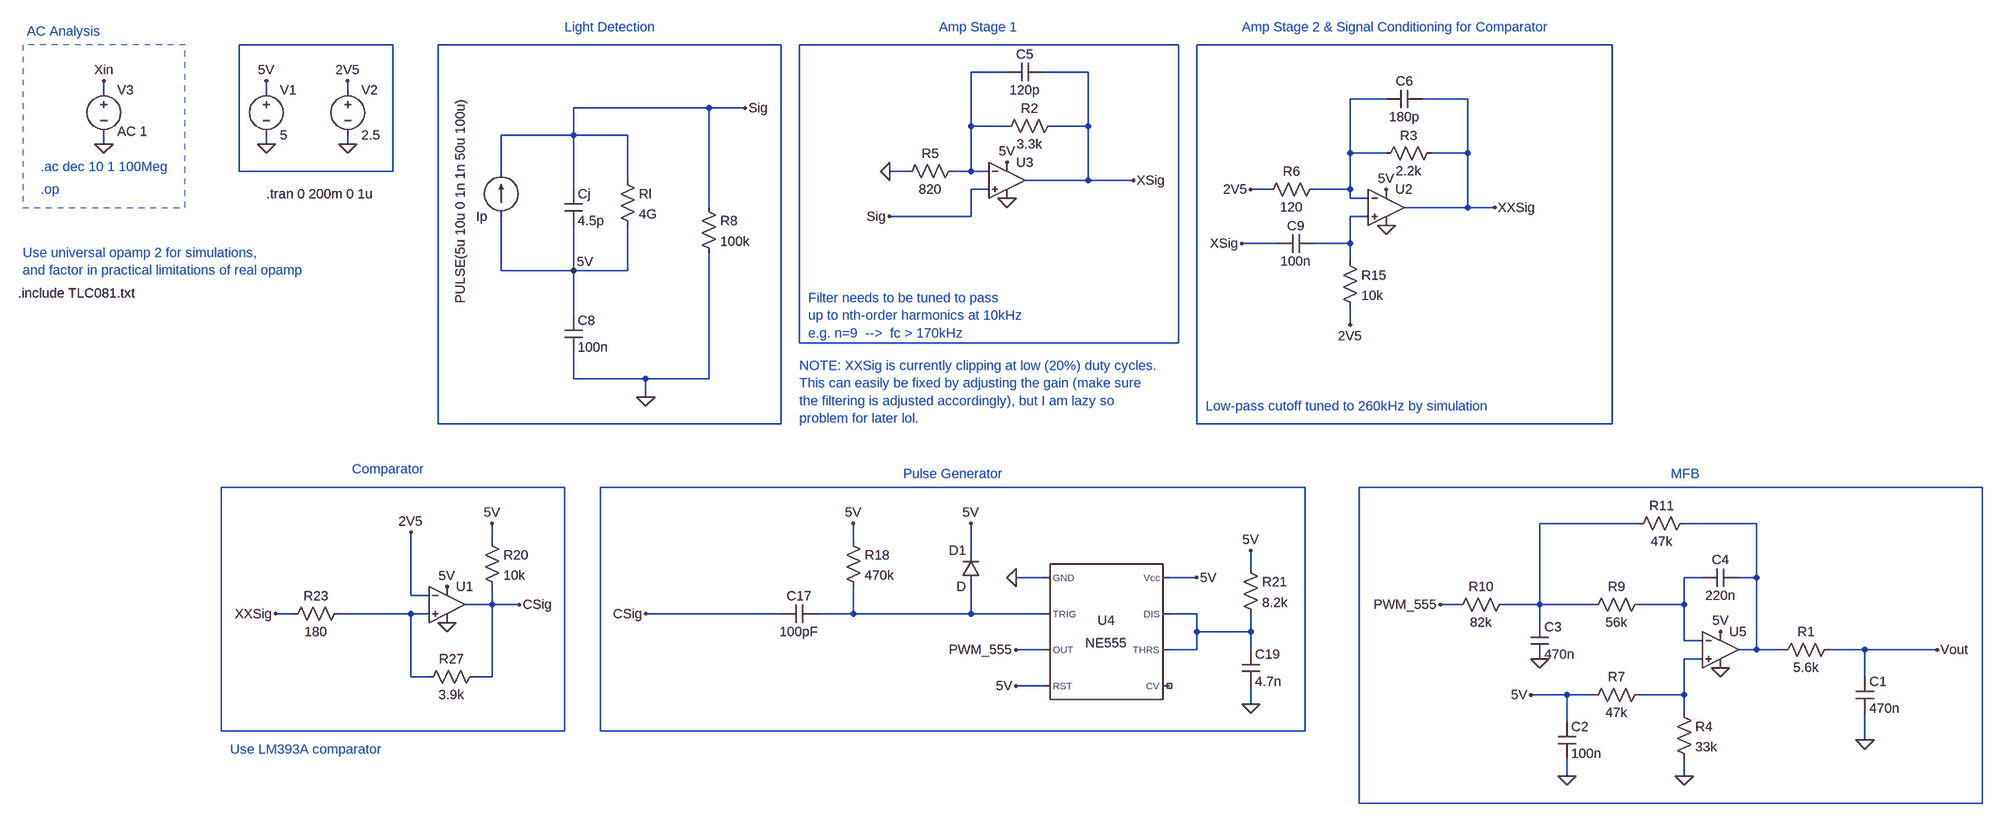
[diagram p0: schematic 310_Rx_Circuit.asc]
310_Rx_Circuit.asc, the LTspice schematic file:
Version 4.1
SHEET 1 2940 1236
WIRE -352 -112 -624 -112
WIRE 336 -112 -272 -112
WIRE 1040 -112 368 -112
WIRE 1808 -112 1072 -112
WIRE 736 -64 672 -64
WIRE 880 -64 800 -64
WIRE -864 -32 -864 -48
WIRE -576 -32 -576 -48
WIRE -432 -32 -432 -48
WIRE 1408 -16 1344 -16
WIRE 1552 -16 1472 -16
WIRE 208 0 -32 0
WIRE 272 0 208 0
WIRE 672 32 672 -64
WIRE 736 32 672 32
WIRE 880 32 880 -64
WIRE 880 32 816 32
WIRE -32 48 -32 0
WIRE -32 48 -160 48
WIRE 64 48 -32 48
WIRE -864 64 -864 48
WIRE -576 64 -576 48
WIRE -432 64 -432 48
WIRE 1344 80 1344 -16
WIRE 1408 80 1344 80
WIRE 1552 80 1552 -16
WIRE 1552 80 1488 80
WIRE -624 112 -624 -112
WIRE -352 112 -352 -112
WIRE -352 112 -624 112
WIRE -160 112 -160 48
WIRE 560 112 528 112
WIRE 672 112 672 32
WIRE 672 112 640 112
WIRE 704 112 672 112
WIRE 64 128 64 48
WIRE 880 128 880 32
WIRE 880 128 768 128
WIRE 960 128 880 128
WIRE -32 144 -32 48
WIRE 704 144 672 144
WIRE 1200 144 1168 144
WIRE 1344 144 1344 80
WIRE 1344 144 1280 144
WIRE 1344 160 1344 144
WIRE 1376 160 1344 160
WIRE 208 176 208 0
WIRE 1552 176 1552 80
WIRE 1552 176 1440 176
WIRE 1600 176 1552 176
WIRE 672 192 672 144
WIRE 672 192 528 192
WIRE 1376 192 1344 192
WIRE 1216 240 1152 240
WIRE 1344 240 1344 192
WIRE 1344 240 1280 240
WIRE 1344 272 1344 240
WIRE -160 288 -160 192
WIRE -32 288 -32 208
WIRE -32 288 -160 288
WIRE 64 288 64 208
WIRE 64 288 -32 288
WIRE -32 368 -32 288
WIRE 1344 384 1344 352
WIRE 368 416 368 -112
WIRE 1040 416 1040 -112
WIRE 1040 416 368 416
WIRE -32 480 -32 432
WIRE 96 480 -32 480
WIRE 208 480 208 256
WIRE 208 480 96 480
WIRE 96 512 96 480
WIRE -272 560 -272 -112
WIRE 336 560 336 -112
WIRE 336 560 -272 560
WIRE 1072 560 1072 -112
WIRE 1808 560 1808 -112
WIRE 1808 560 1072 560
WIRE -48 672 -656 672
WIRE 1264 672 16 672
WIRE 2464 672 1360 672
WIRE 1856 736 1680 736
WIRE 2064 736 1936 736
WIRE -176 768 -176 736
WIRE 464 768 464 736
WIRE 672 784 672 736
WIRE 1168 816 1168 784
WIRE 800 832 752 832
WIRE 1072 832 1024 832
WIRE 1968 832 1936 832
WIRE 2064 832 2064 736
WIRE 2064 832 2032 832
WIRE -320 864 -320 752
WIRE -288 864 -320 864
WIRE -176 880 -176 848
WIRE -176 880 -224 880
WIRE -128 880 -176 880
WIRE 1536 880 1504 880
WIRE 1680 880 1680 736
WIRE 1680 880 1616 880
WIRE 1776 880 1680 880
WIRE 1936 880 1936 832
WIRE 1936 880 1856 880
WIRE -528 896 -560 896
WIRE -320 896 -448 896
WIRE -288 896 -320 896
WIRE 336 896 96 896
WIRE 464 896 464 848
WIRE 464 896 400 896
WIRE 672 896 672 848
WIRE 672 896 464 896
WIRE 800 896 672 896
WIRE 1072 896 1024 896
WIRE 1680 912 1680 880
WIRE 1072 928 1072 896
WIRE 1168 928 1168 896
WIRE 1168 928 1072 928
WIRE 1936 944 1936 880
WIRE 1968 944 1936 944
WIRE 800 960 752 960
WIRE 1072 960 1072 928
WIRE 1072 960 1024 960
WIRE 1168 960 1168 928
WIRE 2064 960 2064 832
WIRE 2064 960 2032 960
WIRE 2112 960 2064 960
WIRE 2256 960 2192 960
WIRE 2384 960 2256 960
WIRE 1968 976 1936 976
WIRE -320 1008 -320 896
WIRE -288 1008 -320 1008
WIRE -176 1008 -176 880
WIRE -176 1008 -208 1008
WIRE 2256 1008 2256 960
WIRE 800 1024 752 1024
WIRE 1728 1040 1664 1040
WIRE 1776 1040 1728 1040
WIRE 1936 1040 1936 976
WIRE 1936 1040 1856 1040
WIRE 1168 1056 1168 1024
WIRE 1936 1072 1936 1040
WIRE 1728 1088 1728 1040
WIRE -656 1104 -656 672
WIRE -48 1104 -48 672
WIRE -48 1104 -656 1104
WIRE 16 1104 16 672
WIRE 1264 1104 1264 672
WIRE 1264 1104 16 1104
WIRE 2256 1120 2256 1072
WIRE 1728 1184 1728 1152
WIRE 1936 1184 1936 1152
WIRE 1360 1232 1360 672
WIRE 2464 1232 2464 672
WIRE 2464 1232 1360 1232
FLAG -576 -48 5V
FLAG -576 64 0
FLAG -432 -48 2V5
FLAG -432 64 0
FLAG -256 848 5V
FLAG -256 912 0
FLAG -320 752 2V5
FLAG -560 896 XXSig
FLAG -128 880 CSig
FLAG 1072 832 5V
FLAG 752 832 0
FLAG 752 960 PWM_555
FLAG 752 1024 5V
FLAG 464 736 5V
FLAG 672 736 5V
FLAG 96 896 CSig
FLAG 1168 784 5V
FLAG 1168 1056 0
FLAG -32 288 5V
FLAG 96 512 0
FLAG 272 0 Sig
FLAG 960 128 XSig
FLAG 528 112 0
FLAG 528 192 Sig
FLAG 736 160 0
FLAG 736 96 5V
FLAG 1344 384 2V5
FLAG 1600 176 XXSig
FLAG 1408 144 5V
FLAG 1408 208 0
FLAG 1168 144 2V5
FLAG -176 736 5V
FLAG -864 64 0
FLAG -864 -48 Xin
FLAG 1152 240 XSig
FLAG 2256 1120 0
FLAG 1936 1184 0
FLAG 1664 1040 5V
FLAG 1728 1184 0
FLAG 1680 976 0
FLAG 2000 928 5V
FLAG 2000 992 0
FLAG 1504 880 PWM_555
FLAG 2384 960 Vout
SYMBOL voltage -576 -48 R0
WINDOW 123 0 0 Left 0
WINDOW 39 0 0 Left 0
SYMATTR InstName V1
SYMATTR Value 5
SYMBOL voltage -432 -48 R0
WINDOW 123 0 0 Left 0
WINDOW 39 0 0 Left 0
SYMATTR InstName V2
SYMATTR Value 2.5
SYMBOL res -432 880 R90
WINDOW 0 0 56 VBottom 2
WINDOW 3 32 56 VTop 2
SYMATTR InstName R23
SYMATTR Value 180
SYMBOL res -304 1024 R270
WINDOW 0 32 56 VTop 2
WINDOW 3 0 56 VBottom 2
SYMATTR InstName R27
SYMATTR Value 3.9k
SYMBOL Misc\\NE555 912 928 R0
SYMATTR InstName U4
SYMBOL res 448 752 R0
SYMATTR InstName R18
SYMATTR Value 470k
SYMBOL cap 400 880 R90
WINDOW 0 0 32 VBottom 2
WINDOW 3 32 32 VTop 2
SYMATTR InstName C17
SYMATTR Value 100pF
SYMBOL res 1152 800 R0
SYMATTR InstName R21
SYMATTR Value 8.2k
SYMBOL cap 1152 960 R0
SYMATTR InstName C19
SYMATTR Value 4.7n
SYMBOL current -160 192 R180
WINDOW 3 72 -155 VRight 2
WINDOW 123 0 0 Left 0
WINDOW 39 0 0 Left 0
SYMATTR Value PULSE(5u 10u 0 1n 1n 50u 100u)
SYMATTR InstName Ip
SYMBOL cap -48 144 R0
SYMATTR InstName Cj
SYMATTR Value 4.5p
SYMBOL res 48 112 R0
SYMATTR InstName Rl
SYMATTR Value 4G
SYMBOL cap -48 368 R0
SYMATTR InstName C8
SYMATTR Value 100n
SYMBOL res 192 160 R0
SYMATTR InstName R8
SYMATTR Value 100k
SYMBOL res 832 16 R90
WINDOW 0 0 56 VBottom 2
WINDOW 3 32 56 VTop 2
SYMATTR InstName R2
SYMATTR Value 3.3k
SYMBOL res 656 96 R90
WINDOW 0 0 56 VBottom 2
WINDOW 3 32 56 VTop 2
SYMATTR InstName R5
SYMATTR Value 820
SYMBOL res 1328 256 R0
SYMATTR InstName R15
SYMATTR Value 10k
SYMBOL cap 1280 224 R90
WINDOW 0 0 32 VBottom 2
WINDOW 3 32 32 VTop 2
SYMATTR InstName C9
SYMATTR Value 100n
SYMBOL res 1504 64 R90
WINDOW 0 0 56 VBottom 2
WINDOW 3 32 56 VTop 2
SYMATTR InstName R3
SYMATTR Value 2.2k
SYMBOL res 1296 128 R90
WINDOW 0 0 56 VBottom 2
WINDOW 3 32 56 VTop 2
SYMATTR InstName R6
SYMATTR Value 120
SYMBOL res -192 752 R0
SYMATTR InstName R20
SYMATTR Value 10k
SYMBOL OpAmps\\UniversalOpAmp2 -256 880 R0
SYMATTR InstName U1
SYMBOL OpAmps\\UniversalOpAmp2 1408 176 R0
SYMATTR InstName U2
SYMBOL OpAmps\\UniversalOpAmp2 736 128 R0
SYMATTR InstName U3
SYMBOL voltage -864 -48 R0
WINDOW 3 24 89 Left 2
WINDOW 123 24 72 Left 2
WINDOW 39 0 0 Left 0
SYMATTR Value AC 1
SYMATTR InstName V3
SYMBOL diode 688 848 R180
WINDOW 0 24 64 Left 2
WINDOW 3 24 0 Left 2
SYMATTR InstName D1
SYMBOL OpAmps\\UniversalOpAmp2 2000 960 R0
SYMATTR InstName U5
SYMBOL res 2208 944 R90
WINDOW 0 0 56 VBottom 2
WINDOW 3 32 56 VTop 2
SYMATTR InstName R1
SYMATTR Value 5.6k
SYMBOL cap 2240 1008 R0
SYMATTR InstName C1
SYMATTR Value 470n
SYMBOL res 1920 1056 R0
SYMATTR InstName R4
SYMATTR Value 33k
SYMBOL res 1872 1024 R90
WINDOW 0 0 56 VBottom 2
WINDOW 3 32 56 VTop 2
SYMATTR InstName R7
SYMATTR Value 47k
SYMBOL cap 1712 1088 R0
SYMATTR InstName C2
SYMATTR Value 100n
SYMBOL res 1872 864 R90
WINDOW 0 0 56 VBottom 2
WINDOW 3 32 56 VTop 2
SYMATTR InstName R9
SYMATTR Value 56k
SYMBOL res 1632 864 R90
WINDOW 0 0 56 VBottom 2
WINDOW 3 32 56 VTop 2
SYMATTR InstName R10
SYMATTR Value 82k
SYMBOL cap 1664 912 R0
SYMATTR InstName C3
SYMATTR Value 470n
SYMBOL cap 2032 816 R90
WINDOW 0 0 32 VBottom 2
WINDOW 3 32 32 VTop 2
SYMATTR InstName C4
SYMATTR Value 220n
SYMBOL res 1952 720 R90
WINDOW 0 0 56 VBottom 2
WINDOW 3 32 56 VTop 2
SYMATTR InstName R11
SYMATTR Value 47k
SYMBOL cap 800 -80 R90
WINDOW 0 0 32 VBottom 2
WINDOW 3 32 32 VTop 2
SYMATTR InstName C5
SYMATTR Value 120p
SYMBOL cap 1472 -32 R90
WINDOW 0 0 32 VBottom 2
WINDOW 3 32 32 VTop 2
SYMATTR InstName C6
SYMATTR Value 180p
TEXT -48 -144 Left 2 ;Light Detection
TEXT 616 -144 Left 2 ;Amp Stage 1
TEXT -576 152 Left 2 !.tran 0 200m 0 1u
TEXT 1152 -144 Left 2 ;Amp Stage 2 & Signal Conditioning for Comparator
TEXT -424 640 Left 2 ;Comparator
TEXT -1016 328 Left 2 !.include TLC081.txt
TEXT -976 104 Left 2 ;.ac dec 10 1 100Meg
TEXT -976 144 Left 2 ;.op
TEXT -1008 256 Left 2 ;Use universal opamp 2 for simulations, \nand factor in practical limitations of real opamp
TEXT -640 1136 Left 2 ;Use LM393A comparator
TEXT 384 336 Left 2 ;Filter needs to be tuned to pass \nup to nth-order harmonics at 10kHz\ne.g. n=9  -->  fc > 170kHz
TEXT 1088 528 Left 2 ;Low-pass cutoff tuned to 260kHz by simulation
TEXT -1000 -136 Left 2 ;AC Analysis
TEXT 368 456 Left 2 ;NOTE: XXSig is currently clipping at low (20%) duty cycles.\nThis can easily be fixed by adjusting the gain (make sure \nthe filtering is adjusted accordingly), but I am lazy so\nproblem for later lol.
TEXT 552 648 Left 2 ;Pulse Generator
TEXT 1912 648 Left 2 ;MFB
LINE Normal -720 176 -720 -112 2
LINE Normal -1008 176 -720 176 2
LINE Normal -1008 -112 -1008 176 2
LINE Normal -720 -112 -1008 -112 2

The netlist it stands for:
* 310_Rx_Circuit.asc
V1 5V 0 5
V2 2V5 0 2.5
R23 N014 XXSig 180
R27 N014 CSig 3.9k
X§U4 0 N015 PWM_555 5V NC_01 N016 N016 5V NE555  ; pins GND TRIG OUT RST CV THRS DIS Vcc
R18 5V N015 470k
C17 N015 CSig 100pF
R21 5V N016 8.2k
C19 N016 0 4.7n
Ip 5V Sig PULSE(5u 10u 0 1n 1n 50u 100u)
Cj Sig 5V 4.5p
Rl Sig 5V 4G
C8 5V 0 100n
R8 Sig 0 100k
R2 XSig N005 3.3k
R5 N005 0 820
R15 N007 2V5 10k
C9 N007 XSig 100n
R3 XXSig N006 2.2k
R6 N006 2V5 120
R20 5V CSig 10k
X§U1 N014 2V5 5V 0 CSig level2 Avol=1Meg GBW=10Meg Slew=10Meg Ilimit=25m Rail=0 Vos=0 En=0 Enk=0 In=0 Ink=0 Rin=500Meg  ; pins In+ In- V+ V- OUT
X§U2 N007 N006 5V 0 XXSig level2 Avol=1Meg GBW=10Meg Slew=10Meg Ilimit=25m Rail=0 Vos=0 En=0 Enk=0 In=0 Ink=0 Rin=500Meg  ; pins In+ In- V+ V- OUT
X§U3 Sig N005 5V 0 XSig level2 Avol=1Meg GBW=10Meg Slew=10Meg Ilimit=25m Rail=0 Vos=0 En=0 Enk=0 In=0 Ink=0 Rin=500Meg  ; pins In+ In- V+ V- OUT
V3 Xin 0 AC 1
D1 N015 5V D
X§U5 N017 N013 5V 0 N012 level2 Avol=1Meg GBW=10Meg Slew=10Meg Ilimit=25m Rail=0 Vos=0 En=0 Enk=0 In=0 Ink=0 Rin=500Meg  ; pins In+ In- V+ V- OUT
R1 Vout N012 5.6k
C1 Vout 0 470n
R4 N017 0 33k
R7 N017 5V 47k
C2 5V 0 100n
R9 N013 N011 56k
R10 N011 PWM_555 82k
C3 N011 0 470n
C4 N012 N013 220n
R11 N012 N011 47k
C5 XSig N005 120p
C6 XXSig N006 180p
.model D D
.lib standard.dio
* Light Detection
* Amp Stage 1
.tran 0 200m 0 1u
* Amp Stage 2 & Signal Conditioning for Comparator
* Comparator
.include TLC081.txt
* .ac dec 10 1 100Meg
* .op
* Use universal opamp 2 for simulations,
* and factor in practical limitations of real opamp
* Use LM393A comparator
* Filter needs to be tuned to pass
* up to nth-order harmonics at 10kHz
* e.g. n=9  -->  fc > 170kHz
* Low-pass cutoff tuned to 260kHz by simulation
* AC Analysis
* NOTE: XXSig is currently clipping at low (20%) duty cycles.
* This can easily be fixed by adjusting the gain (make sure
* the filtering is adjusted accordingly), but I am lazy so
* problem for later lol.
* Pulse Generator
* MFB
.lib NE555.sub
.lib UniversalOpAmp2.lib
.backanno
.end